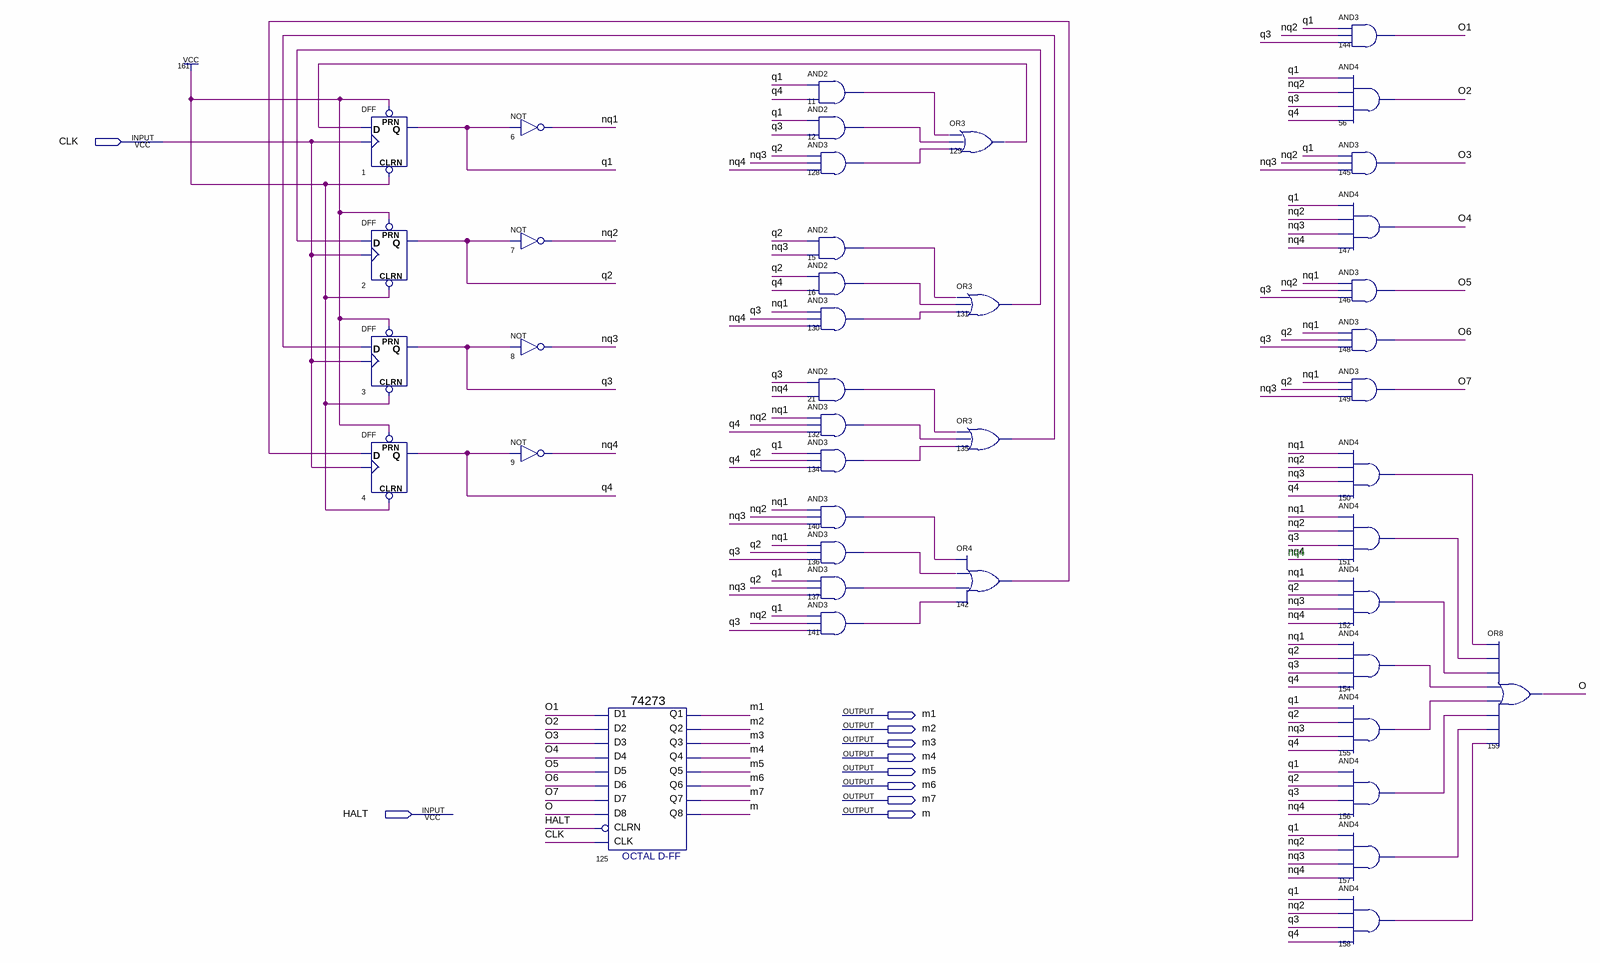
[diagram p0: schematic sheet]
// Quartus schematic timer.bdf as structural Verilog: 42 symbols, 10 pins
module timer (
  input  CLK,
  input  HALT,
  output m1,
  output m2,
  output m3,
  output m4,
  output m5,
  output m6,
  output m7,
  output m
);

  wire n11_out, n12_out, n15_out, n16_out, n21_out, n128_out, n129_out, n130_out, n131_out, n132_out,
       n134_out, n135_out, n136_out, n137_out, n140_out, n141_out, n142_out, n150_out, n151_out, n152_out,
       n154_out, n155_out, n156_out, n157_out, n158_out, nq1, nq2, nq3, nq4, O, O1, O2, O3, O4, O5, O6, O7,
       q1, q2, q3, q4;

  DFF u_1 (.CLRN(1'b1), .CLK(CLK), .D(n129_out), .PRN(1'b1), .Q(q1));
  DFF u_2 (.CLRN(1'b1), .CLK(CLK), .D(n131_out), .PRN(1'b1), .Q(q2));
  DFF u_3 (.CLRN(1'b1), .CLK(CLK), .D(n135_out), .PRN(1'b1), .Q(q3));
  DFF u_4 (.CLRN(1'b1), .CLK(CLK), .D(n142_out), .PRN(1'b1), .Q(q4));
  not u_6 (nq1, q1);
  not u_7 (nq2, q2);
  not u_8 (nq3, q3);
  not u_9 (nq4, q4);
  \74273  u_125 (
    .D1(O1), .D2(O2), .D3(O3), .D4(O4), .D5(O5), .D6(O6), .D7(O7), .CLK(CLK), .D8(O), .CLRN(HALT), .Q1(m1),
    .Q2(m2), .Q3(m3), .Q4(m4), .Q5(m5), .Q6(m6), .Q7(m7), .Q8(m));
  and u_11 (n11_out, q1, q4);
  and u_12 (n12_out, q1, q3);
  and u_128 (n128_out, q2, nq3, nq4);
  and u_15 (n15_out, q2, nq3);
  and u_16 (n16_out, q2, q4);
  and u_130 (n130_out, nq1, q3, nq4);
  and u_21 (n21_out, q3, nq4);
  and u_132 (n132_out, nq1, nq2, q4);
  and u_134 (n134_out, q1, q2, q4);
  and u_140 (n140_out, nq1, nq2, nq3);
  and u_136 (n136_out, nq1, q2, q3);
  and u_137 (n137_out, q1, q2, nq3);
  and u_141 (n141_out, q1, nq2, q3);
  or u_129 (n129_out, n11_out, n12_out, n128_out);
  or u_131 (n131_out, n15_out, n16_out, n130_out);
  or u_135 (n135_out, n21_out, n132_out, n134_out);
  or u_142 (n142_out, n140_out, n136_out, n137_out, n141_out);
  and u_144 (O1, q1, nq2, q3);
  and u_56 (O2, q1, nq2, q3, q4);
  and u_145 (O3, q1, nq2, nq3);
  and u_147 (O4, q1, nq2, nq3, nq4);
  and u_146 (O5, nq1, nq2, q3);
  and u_148 (O6, nq1, q2, q3);
  and u_149 (O7, nq1, q2, nq3);
  and u_150 (n150_out, nq1, nq2, nq3, q4);
  and u_151 (n151_out, nq1, nq2, q3, nq4);
  and u_152 (n152_out, nq1, q2, nq3, nq4);
  and u_154 (n154_out, nq1, q2, q3, q4);
  and u_155 (n155_out, q1, q2, nq3, q4);
  and u_156 (n156_out, q1, q2, q3, nq4);
  and u_157 (n157_out, q1, nq2, nq3, nq4);
  and u_158 (n158_out, q1, nq2, q3, q4);
  or u_159 (O, n150_out, n151_out, n152_out, n154_out, n155_out, n156_out, n157_out, n158_out);

  // Notes on the sheet:
  //   nq4
endmodule
